# EAGLE design Pihome Zone Relay (EAGLE 9.0.1)
PiHome - Smart Heating Control Multi Zone Controller Relay Based on MySensors Library with Arduino 5v to Control Motorized Valve for Each Zone.
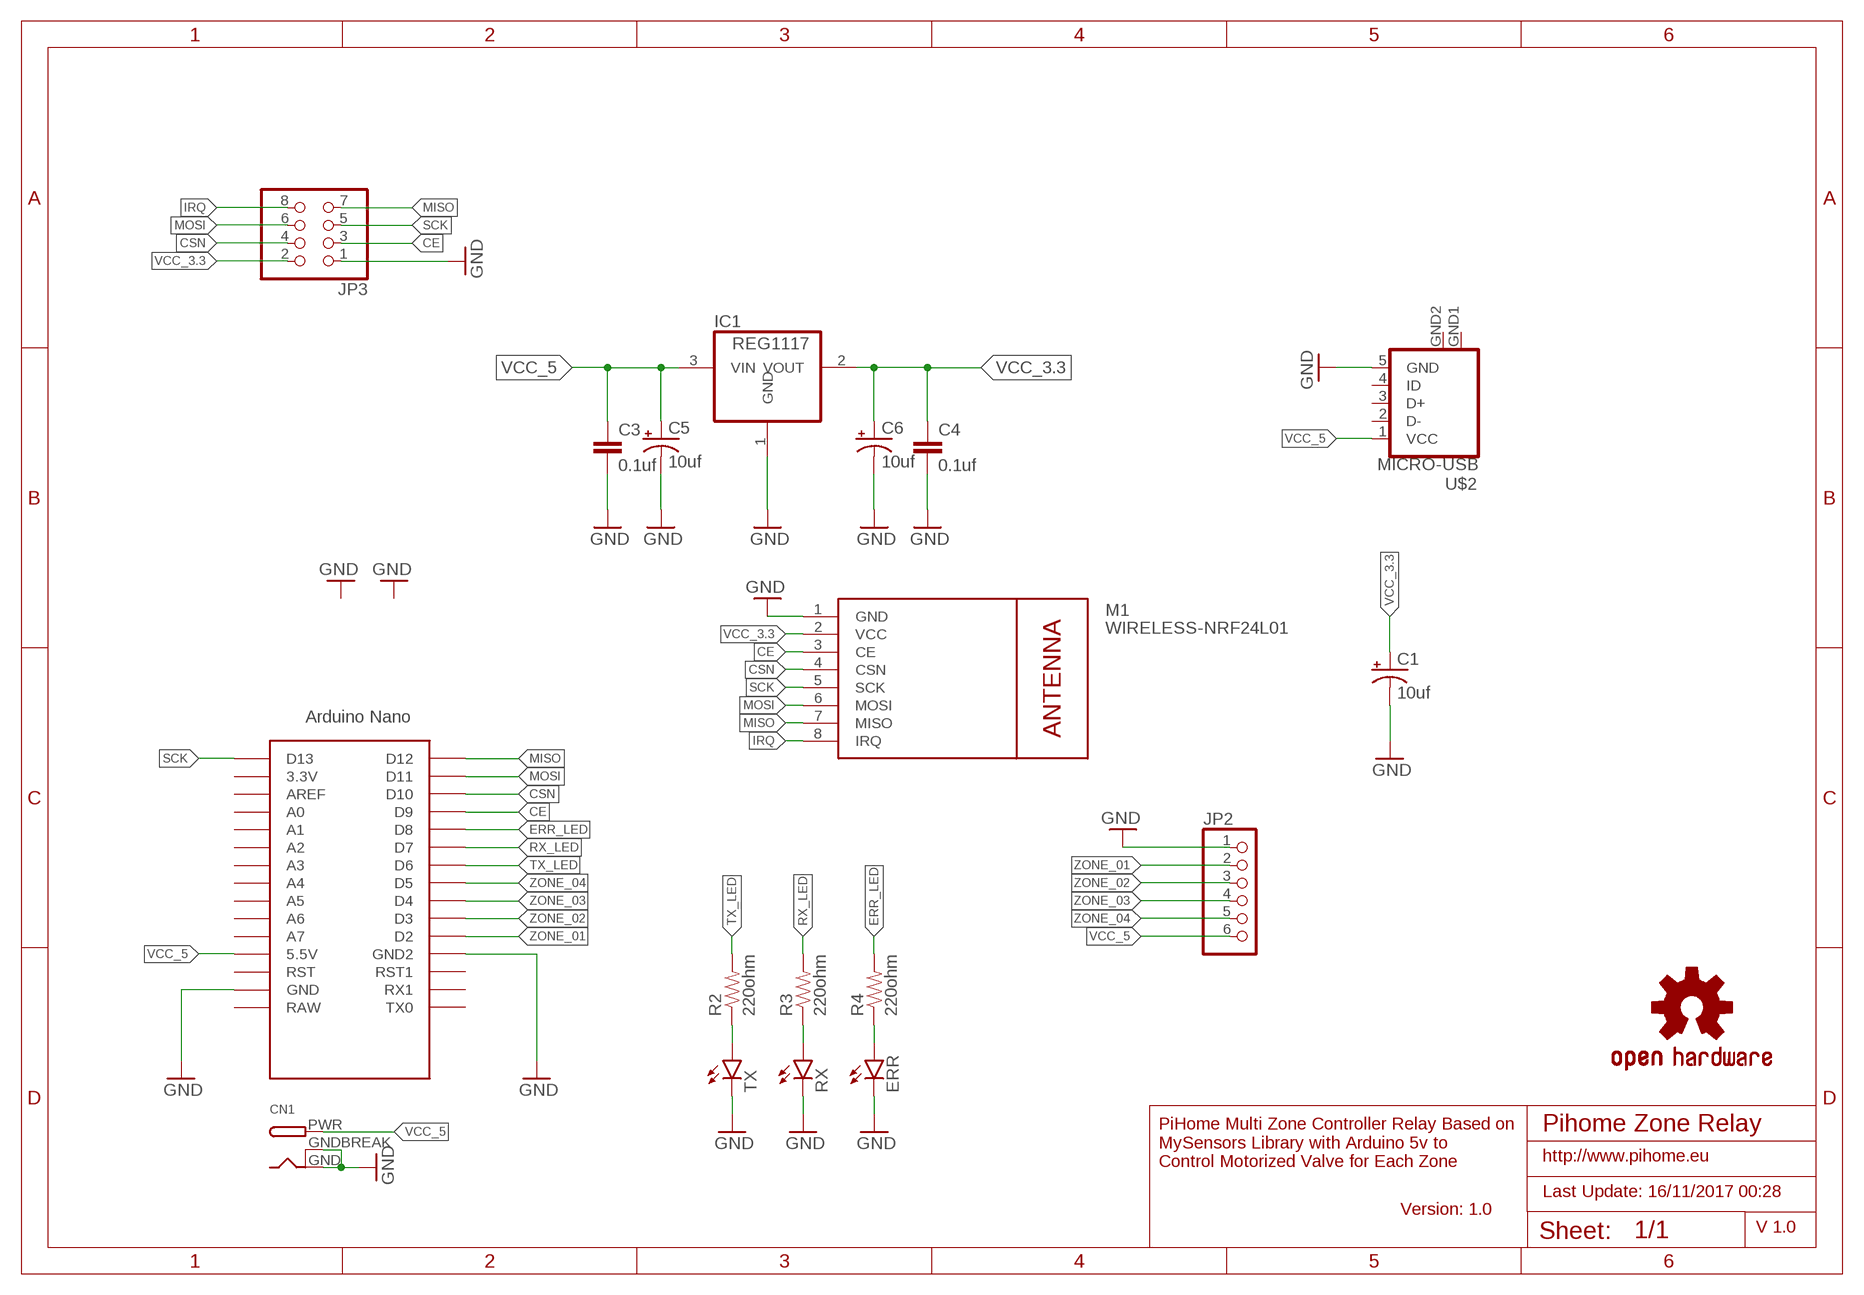
[diagram p0: schematic, sheet 1]

## Parts
C1  10uf  10UF-25V-20%(PTH)KIT  [CPOL-RADIAL-10UF-25V-KIT]
C3  0.1uf  0.1UF-50V-20%(PTH)KIT-EZ  [CAP-PTH-SMALL-KIT]
C4  0.1uf  0.1UF-50V-20%(PTH)KIT-EZ  [CAP-PTH-SMALL-KIT]
C5  10uf  10UF-25V-20%(PTH)KIT  [CPOL-RADIAL-10UF-25V-KIT]
C6  10uf  10UF-25V-20%(PTH)KIT  [CPOL-RADIAL-10UF-25V-KIT]
CN1  DCBARRELPTH  [DCJACK_2MM_PTH]
ERR  LED3MM  [LED3MM]
IC1  REG1117  [SOT223]
JP2  PINHD-1X6  [1X06]
JP3  PINHD-2X4  [2X04]
LOGO4  OSHW-LOGOM  [OSHW-LOGO-M]
M1  WIRELESS-NRF24L01  [WIRELESS-NRF24L01]
R2  220ohm  RESISTORAXIAL-0.3  [AXIAL-0.3]
R3  220ohm  RESISTORAXIAL-0.3  [AXIAL-0.3]
R4  220ohm  RESISTORAXIAL-0.3  [AXIAL-0.3]
RX  LED3MM  [LED3MM]
TX  LED3MM  [LED3MM]
U$1  NANO  [NANO]
U$2  MICRO-USB  [MICRO-USB]

## Nets
CE: JP3.3 M1.3(CE) U$1.D9
CSN: JP3.4 M1.4(CSN) U$1.D10
ERR_LED: R4.P$2 U$1.D8
GND: C1.2(-) C3.2 C4.2 C5.2(-) C6.2(-) CN1.GND CN1.GNDBREAK ERR.K(C) IC1.1(GND) JP2.1 JP3.1 M1.1(GND) RX.K(C) TX.K(C) U$1.GND U$1.GND1(GND2) U$2.5(GND)
IRQ: JP3.8 M1.8(IRQ)
MISO: JP3.7 M1.7(MISO) U$1.D12
MOSI: JP3.6 M1.6(MOSI) U$1.D11
N$5: R2.P$1 TX.A
N$6: R3.P$1 RX.A
N$7: ERR.A R4.P$1
RX_LED: R3.P$2 U$1.D7
SCK: JP3.5 M1.5(SCK) U$1.D13
TX_LED: R2.P$2 U$1.D6
VCC_3.3: C1.1(+) C4.1 C6.1(+) IC1.2(VOUT) JP3.2 M1.2(VCC)
VCC_5: C3.1 C5.1(+) CN1.PWR IC1.3(VIN) JP2.6 U$1.5V(5.5V) U$2.1(VCC)
ZONE_01: JP2.2 U$1.D2
ZONE_02: JP2.3 U$1.D3
ZONE_03: JP2.4 U$1.D4
ZONE_04: JP2.5 U$1.D5
Unconnected: U$1.3.3V U$1.A0 U$1.A1 U$1.A2 U$1.A3 U$1.A4 U$1.A5 U$1.A6 U$1.A7 U$1.AREF U$1.ICSP1 U$1.ICSP2 U$1.ICSP3 U$1.ICSP4 U$1.ICSP5 U$1.ICSP6 U$1.RAW U$1.RST U$1.RST1 U$1.RX1 U$1.TX0 U$2.2(D-) U$2.3(D+) U$2.4(ID)

## Notes on the sheet
- http://www.pihome.eu
- PiHome Multi Zone Controller Relay Based on
  MySensors Library with Arduino 5v to 
  Control Motorized Valve for Each Zone
- Last Update: 16/11/2017 00:28
- Version: 1.0
- V 1.0

## Power pins joined to a net without a drawn wire
GND: U$2.GND1(GND) U$2.GND2(GND)

## Library data of the parts
C1 C5 C6 = SparkFun-Capacitors:10UF-25V-20%(PTH): CAP-08440; PROD_ID: CAP-08440
C3 C4 = SparkFun-Capacitors:0.1UF-50V-20%(PTH): CAP-08370; PROD_ID: CAP-08370
CN1 = adafruit:DCBARREL: 2.0mm DC Barrel Jack DCJACK_2MM_PTH - Through Hole Jack (4UConnector: 05537)
ERR RX TX = SparkFun-LED:LED: LEDs Standard schematic elements and footprints for 5mm, 3mm, 1206, and 0603 sized LEDs. 5mm - Spark Fun Electronics SKU : COM-00529 (and others); PROD_ID: DIO-08794
IC1 = burr-brown:REG1117: 800mA and 1A Low Dropout (LDO) Positive Regulator 1.8V, 2.5V, 2.85V, 3.3V, 5V, and Adj; MPN: REG1117; OC_FARNELL: 1097566; OC_NEWARK: 14P6981
JP2 = adafruit:PINHD-1X6: PIN HEADER
JP3 = adafruit:PINHD-2X4: PIN HEADER
LOGO4 = SparkFun-Aesthetics:OSHW-LOGO: Open Source Hardware Logo This logo indicates the piece of hardware it is found on incorporates a OSHW license and/or adheres to the definition of open source hardware found here: http://freedomdefined.org/OSHW
M1 = diy-modules:WIRELESS-NRF24L01: 2.4 GHz Wireless Module based on NRF24L01 chip More details available here: http://www.electrodragon.com/w/NRF24L01 Click here to find device on ebay.com <http://www.ebay.com/sch/nrf24l01+arduino>
R2-R4 = SparkFun-Passives:RESISTOR: Resistor Basic schematic elements and footprints for 0603, 1206, and PTH resistors.
U$1 = Arduino Pro Mini-Nano:NANO: Arduino Nano
U$2 = microusb:MICRO-USB: Micro USB B connector

## Net classes
0 default: width 0.305 mm, drill 0.508 mm, clearance 0.254 mm

## Board
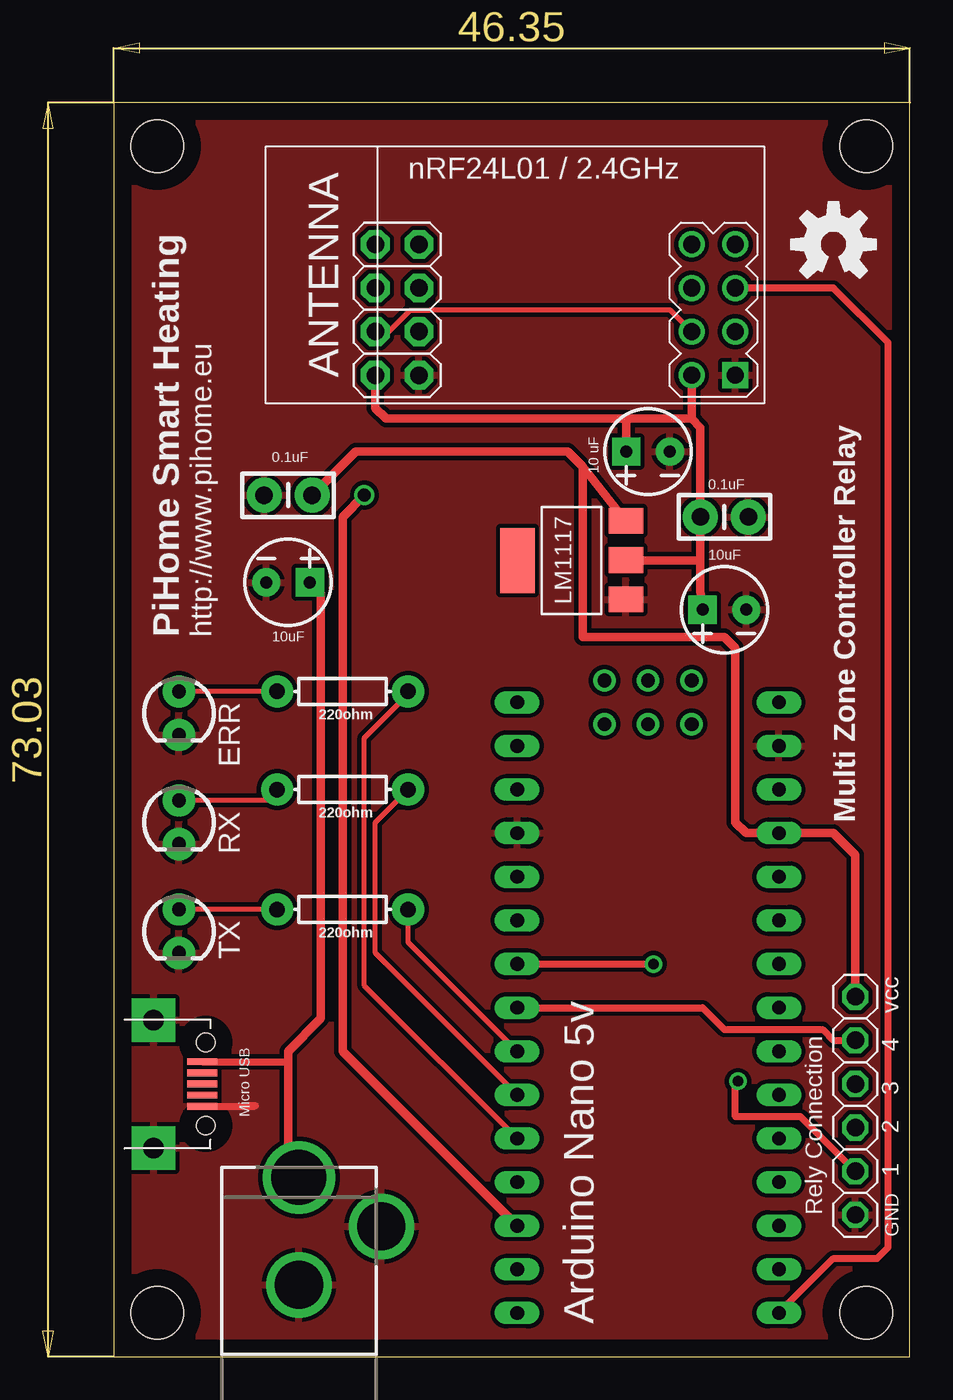
[diagram p1: board, top side]
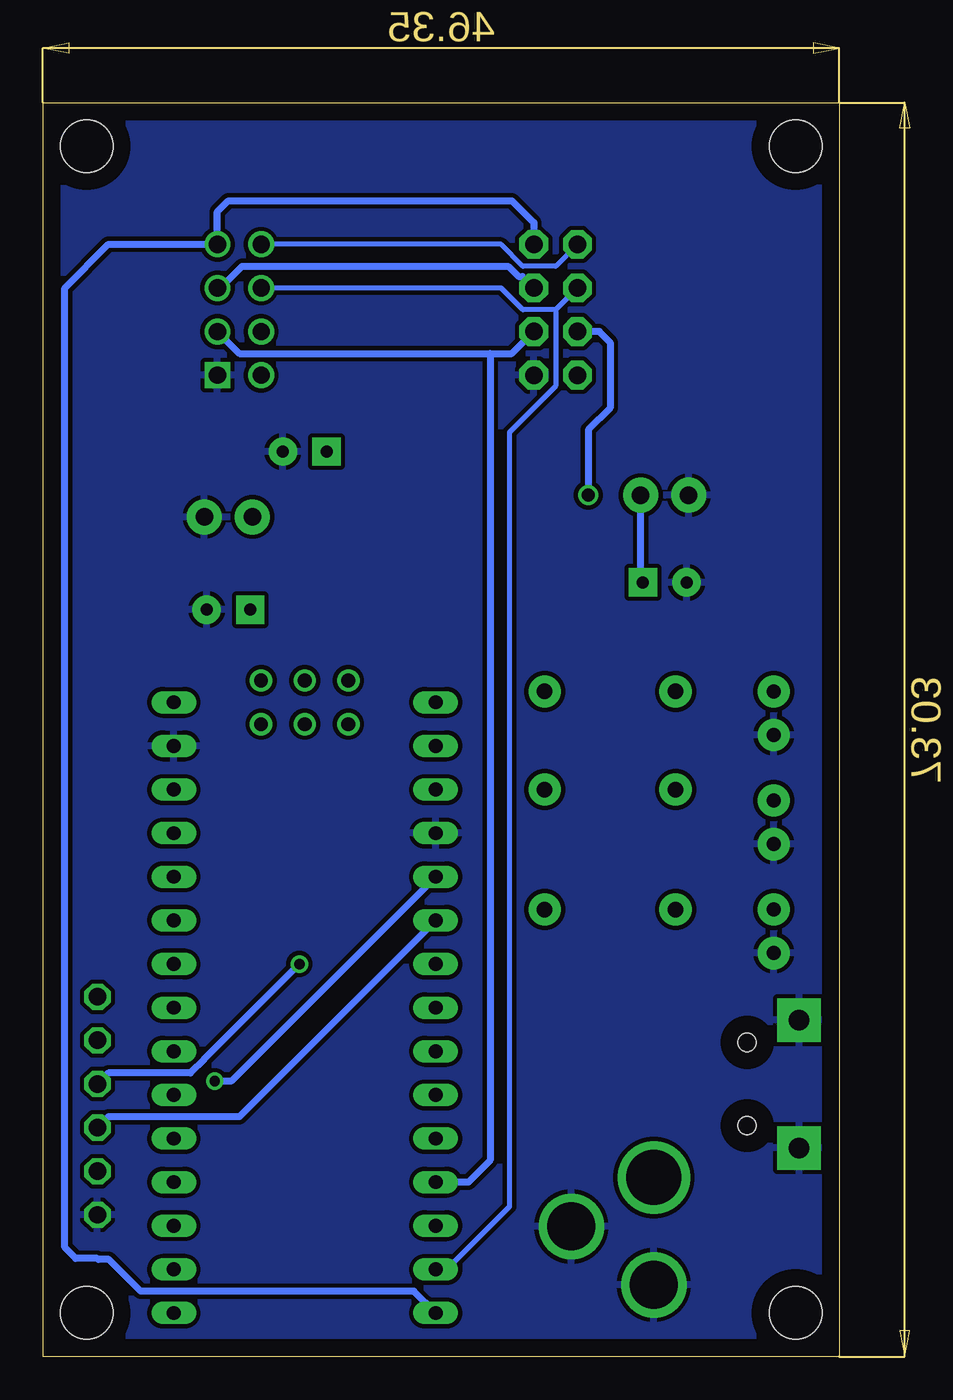
[diagram p2: board, bottom side, seen from below]

Size 46.34 x 73.02 mm. Coordinates in mm from the lower left corner, seen from the top.
Outline: 0,0 46.34,0 46.34,73.02 0,73.02 0,0
Copper layers (1*16): Top 0.035mm / dielectric 1.5mm / Bottom 0.035mm
Design rules "default": minimum track width 10mil, minimum drill 24mil, track to track 8mil, track to pad 8mil, pad to pad 8mil, via to via 8mil, smd to smd 8mil, copper to edge 40mil, drill to drill 8mil, minimum pad ring 10mil, minimum via ring 8mil, stop-mask expansion 4mil, vias tented up to drill 0mil, thermal gap 10mil
Holes 3.05 mm at 2.54,70.48 2.54,2.54 43.81,70.48 43.81,2.54

### Footprints (pad centres in the part's own frame; a part is rotated, then mirrored left to right if it is on the bottom)
CPOL-RADIAL-10UF-25V-KIT = drill 0.7 pad 1.651 square: 1 1.27,0 | drill 0.7 pad 1.651: 2 -1.27,0
CAP-PTH-SMALL-KIT = drill 1.016 pad 2.032: 1 -1.397,0; 2 1.397,0
DCJACK_2MM_PTH = drill 2.8: GND 0,7.35; GNDBREAK 4.8,10.75 | drill 3.2: PWR 0,13.6
LED3MM = drill 0.813 pad 1.88: A -1.27,0; K 1.27,0
SOT223 = smd 1.499 x 2.007: 1 -2.261,-3.15; 2 0.025,-3.15; 3 2.311,-3.15 | smd 3.81 x 2.007: 4 0,3.15
1X06 = drill 1.016 octagon: 1 -6.35,0; 2 -3.81,0; 3 -1.27,0; 4 1.27,0; 5 3.81,0; 6 6.35,0
2X04 = drill 1.016 pad 1.676 octagon: 1 -3.81,-1.27; 2 -3.81,1.27; 3 -1.27,-1.27; 4 -1.27,1.27; 5 1.27,-1.27; 6 1.27,1.27; 7 3.81,-1.27; 8 3.81,1.27
WIRELESS-NRF24L01 = drill 1 square: 1 -12.7,6.35 | drill 1: 2 -10.16,6.35; 3 -12.7,3.81; 4 -10.16,3.81; 5 -12.7,1.27; 6 -10.16,1.27; 7 -12.7,-1.27; 8 -10.16,-1.27
AXIAL-0.3 = drill 0.9 pad 1.88: P$1 -3.81,0; P$2 3.81,0
NANO = drill 0.8 long: 3.3V -10.16,24.13; 5V -10.16,-1.27; A0 -10.16,19.05; A1 -10.16,16.51; A2 -10.16,13.97; A3 -10.16,11.43; A4 -10.16,8.89; A5 -10.16,6.35; A6 -10.16,3.81; A7 -10.16,1.27; AREF -10.16,21.59; D2 5.08,1.27; D3 5.08,3.81; D4 5.08,6.35; D5 5.08,8.89; D6 5.08,11.43; D7 5.08,13.97; D8 5.08,16.51; D9 5.08,19.05; D10 5.08,21.59; D11 5.08,24.13; D12 5.08,26.67; D13 -10.16,26.67; GND -10.16,-6.35; GND1 5.08,-1.27; RAW -10.16,-8.89; RST -10.16,-3.81; RST1 5.08,-3.81; RX1 5.08,-6.35; TX0 5.08,-8.89 | drill 0.8: ICSP1 -5.08,-10.16; ICSP2 -5.08,-7.62; ICSP3 -2.54,-10.16; ICSP4 -2.54,-7.62; ICSP5 0,-10.16; ICSP6 0,-7.62
MICRO-USB = smd 0.4 x 1.75: 1 -1.3,4.525; 2 -0.65,4.525; 3 0,4.525; 4 0.65,4.525; 5 1.3,4.525 | drill 1.2 pad 2.54 square: GND1 -3.725,1.7; GND2 3.725,1.7 | hole 1.05: -2.425,4.73; 2.425,4.73

### Placement (x,y rotation side)
C1  31.11,52.7 180 top
C3  10.16,50.16 180 top
C4  35.56,48.9 0 top
C5  10.16,45.09 0 top
C6  35.56,43.5 180 top
CN1  10.79,-3.17 0 top
ERR  3.81,37.47 270 top
IC1  26.67,46.35 90 top
JP2  43.18,14.61 90 top
JP3  16.51,60.96 90 top
LOGO4  41.91,64.77 0 top
M1  23.5,63.5 180 top
R2  13.34,26.04 0 top
R3  13.34,33.02 0 top
R4  13.34,38.73 0 top
RX  3.81,31.11 270 top
TX  3.81,24.77 270 top
U$1  28.57,29.21 180 top
U$2  0.64,15.88 270 top

### Tracks (layer width: path | path; a pad name or v marks a point on that pad's centre or on a via)
CE
  Bottom 0.305: 22.86,10.16 U$1.D9
  Bottom 0.406: M1.3 34.92,58.42 20.32,58.42 | JP3.3 19.05,58.42 20.32,58.42 | U$1.D9 21.59,10.16 20.32,11.43 20.32,58.42
CSN  (via drill 0.76)
  Top 0.305: JP3.4 16.02,59.69 17.26,60.94 18.39,60.94 18.41,60.96 32.38,60.96 M1.4
  Top 0.406: U$1.D10 20.95,10.16
  Top 0.508: U$1.D10 13.34,17.78 13.34,48.9 v14.61,50.16
  Bottom 0.406: v14.61,50.16 14.61,53.98 13.34,55.24 13.34,59.05 13.97,59.69 JP3.4
ERR_LED
  Top 0.305: R4.P$2 17.14,38.58 14.61,36.04 14.61,21.59 U$1.D8
GND
  Top 0.406: U$2.5 8.22,14.57 8.26,14.61 7.62,14.61
  pour Bottom: 0,0 46.35,0 46.35,73.03 0,73.03
  pour Top: 0,0 46.35,0 46.35,73.03 0,73.03
IRQ
  Bottom 0.305: M1.8 19.68,64.77 18.41,63.5 16.51,63.5 JP3.8
MISO
  Bottom 0.305: 36.35,64.77 M1.7
  Bottom 0.406: U$1.D12 24.77,3.81 40.67,3.81 42.52,5.66 43.13,5.66 43.18,5.71 44.45,5.71 45.09,6.35 45.09,62.23 42.55,64.77 M1.7 36.2,66.67 35.56,67.31 19.05,67.31 17.78,66.04 JP3.7
MOSI
  Bottom 0.305: U$1.D11 22.86,5.08 19.21,8.73 19.21,53.82 16.51,56.52 16.51,60.96 | JP3.6 16.51,60.96 | M1.6 19.68,62.23 18.41,60.96 16.51,60.96
N$5
  Top 0.305: R2.P$1 TX.A
N$6
  Top 0.305: RX.A 8.89,32.38 R3.P$1
N$7
  Top 0.305: R4.P$1 ERR.A
RX_LED
  Top 0.305: U$1.D7 15.24,23.5 15.24,31.11 R3.P$2
SCK
  Top 0.406: U$1.D13 41.91,5.71 44.45,5.71 45.09,6.35 45.09,59.05 41.91,62.23 M1.5
  Bottom 0.406: M1.5 36.04,62.23 34.77,63.5 19.28,63.5 18.67,62.89 18.44,62.89 JP3.5
TX_LED
  Top 0.305: U$1.D6 17.14,24.13 R2.P$2
VCC_3.3
  Top 0.508: JP3.2 15.24,55.24 15.88,54.61 29.84,54.61 | 29.84,54.61 33.66,54.61 | 33.66,54.61 M1.2 | 33.66,54.61 34.16,54.1 C4.1 34.16,46.35 | 34.16,46.35 34.16,44.58 C6.1 | IC1.2 29.84,46.35 34.16,46.35 | C1.1 29.84,54.61
VCC_5
  Top 0.406: U$2.1 10.13,17.18 10.16,17.14
  Top 0.508: JP2.6 43.18,29.21 41.91,30.48 U$1.5V 36.83,30.48 36.2,31.11 36.2,41.27 35.56,41.91 27.3,41.91 27.3,51.84 | C3.1 14.1,52.7 26.44,52.7 27.3,51.84 | 27.3,51.84 IC1.3 | C5.1 12.06,44.45 12.06,19.68 10.16,17.78 10.16,17.14 10.16,11.06 CN1.PWR
  Bottom 0.305: C5.1 11.59,44.93
  Bottom 0.406: C5.1 11.56,45.21 C3.1
ZONE_01  (via drill 0.61)
  Top 0.406: JP2.2 40.01,13.97 36.2,13.97 36.2,15.88 v36.35,16.03
  Bottom 0.406: U$1.D2 35.4,16.03 v36.35,16.03
ZONE_02
  Bottom 0.406: U$1.D3 34.92,13.97 42.55,13.97 JP2.3
ZONE_03  (via drill 0.61)
  Top 0.406: U$1.D4 v31.43,22.86
  Bottom 0.406: v31.43,22.86 36.97,17.32 37.78,16.51 42.55,16.51 JP2.4
ZONE_04
  Top 0.406: U$1.D5 34.29,20.32 35.56,19.05 41.27,19.05 41.91,18.41 JP2.5

### Text on the board
tPlace: 0.1uF | 10 uF | 0.1uF | 10uF | LM1117 | 10uF | vcc | 4 | 3 | Micro USB | 2 | 1 | Rely Connection | GND | Arduino Nano 5v
tNames: nRF24L01 / 2.4GHz | PiHome Smart Heating | http://www.pihome.eu | Multi Zone Controller Relay